# EAGLE design RHD2000_128_headstage (EAGLE 6.5.0)

## Sheet 1 of 3
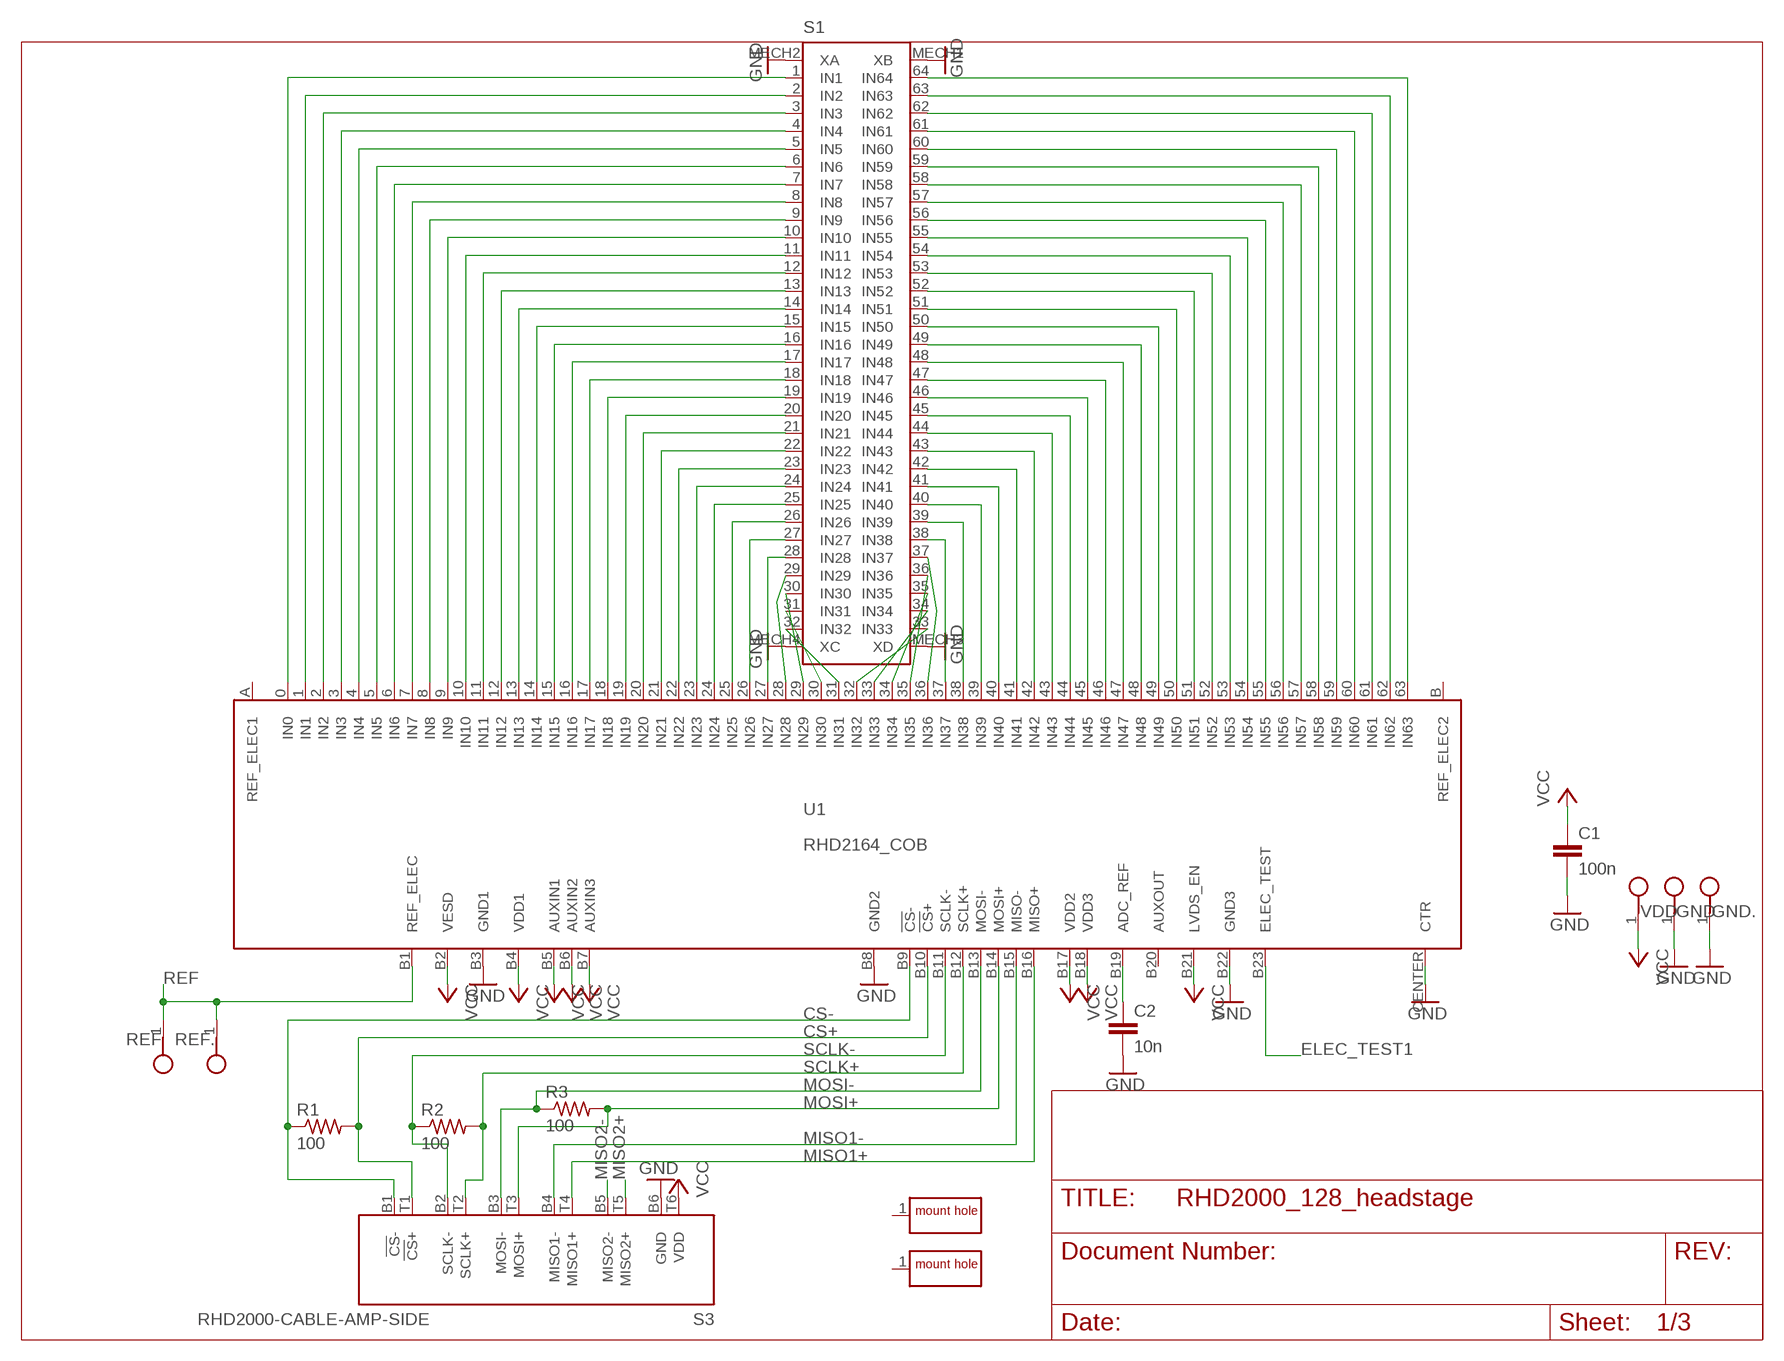
[diagram p0: schematic, sheet 1]

### Parts
C1  100n  C_0402  [0402]
C2  10n  C_0201  [0201]
GND  TESTPOINT_SMALL  [TESTPOINT_SMALL]
GND.  TESTPOINT_SMALL  [TESTPOINT_SMALL]
H1  MOUNTING_HOLE_60MIL  [MOUNTING_HOLE_60MIL]
H2  MOUNTING_HOLE_60MIL  [MOUNTING_HOLE_60MIL]
R1  100  R_0201  [0201]
R2  100  R_0201  [0201]
R3  100  R_0201  [0201]
REF  TESTPOINT_SMALL  [TESTPOINT_SMALL]
REF.  TESTPOINT_SMALL  [TESTPOINT_SMALL]
S1  MOLEX_SLIMSTACK_64  [MOLEX_SLIMSTACK_64]
S3  RHD2000-CABLE-AMP-SIDE  [OMNETICS_PZN-12-AA]
U1  RHD2164_COB  [RHD2164_COB]
VDD  TESTPOINT_SMALL  [TESTPOINT_SMALL]

### Nets
CS+: R1.2 S3.T1(!CS!+) U1.B10(!CS!+) ; also sheet 2
CS-: R1.1 S3.B1(!CS!-) U1.B9(!CS!-) ; also sheet 2
ELEC_TEST1: U1.B23(ELEC_TEST) ; also sheet 3
GND [thick]: C1.2 C2.2 GND.1 GND..1 S1.MECH1(XB) S1.MECH2(XA) S1.MECH3(XD) S1.MECH4(XC) S3.B6(GND) U1.B3(GND1) U1.B8(GND2) U1.B22(GND3) U1.CENTER(CTR) ; also sheet 2,3
MISO1+: S3.T4(MISO1+) U1.B16(MISO+)
MISO1-: S3.B4(MISO1-) U1.B15(MISO-)
MISO2+: S3.T5(MISO2+) ; also sheet 2
MISO2-: S3.B5(MISO2-) ; also sheet 2
MOSI+: R3.2 S3.T3(MOSI+) U1.B14(MOSI+) ; also sheet 2
MOSI-: R3.1 S3.B3(MOSI-) U1.B13(MOSI-) ; also sheet 2
N$2: S1.1(IN1) U1.0(IN0)
N$3: S1.2(IN2) U1.1(IN1)
N$4: S1.3(IN3) U1.2(IN2)
N$5: S1.4(IN4) U1.3(IN3)
N$6: S1.5(IN5) U1.4(IN4)
N$7: S1.6(IN6) U1.5(IN5)
N$8: S1.7(IN7) U1.6(IN6)
N$9: S1.8(IN8) U1.7(IN7)
N$10: S1.9(IN9) U1.8(IN8)
N$12: S1.10(IN10) U1.9(IN9)
N$13: S1.11(IN11) U1.10(IN10)
N$14: S1.12(IN12) U1.11(IN11)
N$15: S1.13(IN13) U1.12(IN12)
N$16: S1.14(IN14) U1.13(IN13)
N$17: S1.15(IN15) U1.14(IN14)
N$18: S1.16(IN16) U1.15(IN15)
N$19: S1.17(IN17) U1.16(IN16)
N$20: S1.18(IN18) U1.17(IN17)
N$21: S1.19(IN19) U1.18(IN18)
N$22: S1.20(IN20) U1.19(IN19)
N$23: S1.21(IN21) U1.20(IN20)
N$24: S1.22(IN22) U1.21(IN21)
N$25: S1.23(IN23) U1.22(IN22)
N$26: S1.24(IN24) U1.23(IN23)
N$27: S1.25(IN25) U1.24(IN24)
N$28: S1.26(IN26) U1.25(IN25)
N$29: S1.27(IN27) U1.26(IN26)
N$30: S1.28(IN28) U1.27(IN27)
N$31: S1.38(IN38) U1.37(IN37)
N$32: S1.39(IN39) U1.38(IN38)
N$33: S1.64(IN64) U1.63(IN63)
N$34: S1.63(IN63) U1.62(IN62)
N$41: S1.62(IN62) U1.61(IN61)
N$42 [thick]: C2.1 U1.B19(ADC_REF)
N$43: S1.61(IN61) U1.60(IN60)
N$44: S1.60(IN60) U1.59(IN59)
N$45: S1.59(IN59) U1.58(IN58)
N$46: S1.58(IN58) U1.57(IN57)
N$47: S1.57(IN57) U1.56(IN56)
N$48: S1.56(IN56) U1.55(IN55)
N$49: S1.55(IN55) U1.54(IN54)
N$50: S1.54(IN54) U1.53(IN53)
N$51: S1.53(IN53) U1.52(IN52)
N$52: S1.52(IN52) U1.51(IN51)
N$53: S1.51(IN51) U1.50(IN50)
N$54: S1.50(IN50) U1.49(IN49)
N$55: S1.49(IN49) U1.48(IN48)
N$56: S1.48(IN48) U1.47(IN47)
N$57: S1.47(IN47) U1.46(IN46)
N$58: S1.46(IN46) U1.45(IN45)
N$59: S1.45(IN45) U1.44(IN44)
N$60: S1.44(IN44) U1.43(IN43)
N$61: S1.43(IN43) U1.42(IN42)
N$62: S1.42(IN42) U1.41(IN41)
N$63: S1.41(IN41) U1.40(IN40)
N$64: S1.40(IN40) U1.39(IN39)
N$65: S1.32(IN32) U1.31(IN31)
N$66: S1.31(IN31) U1.30(IN30)
N$67: S1.30(IN30) U1.29(IN29)
N$68: S1.29(IN29) U1.28(IN28)
N$69: S1.33(IN33) U1.32(IN32)
N$70: S1.34(IN34) U1.33(IN33)
N$71: S1.35(IN35) U1.34(IN34)
N$72: S1.36(IN36) U1.35(IN35)
N$73: S1.37(IN37) U1.36(IN36)
REF [thick]: REF.1 REF..1 U1.B1(REF_ELEC) ; also sheet 2,3
SCLK+: R2.2 S3.T2(SCLK+) U1.B12(SCLK+) ; also sheet 2
SCLK-: R2.1 S3.B2(SCLK-) U1.B11(SCLK-) ; also sheet 2
VCC [thick]: C1.1 S3.T6(VDD) U1.B2(VESD) U1.B4(VDD1) U1.B5(AUXIN1) U1.B6(AUXIN2) U1.B7(AUXIN3) U1.B17(VDD2) U1.B18(VDD3) U1.B21(LVDS_EN) VDD.1 ; also sheet 2,3
Unconnected: H1.1 H2.1 U1.A(REF_ELEC1) U1.B20(AUXOUT) U1.B(REF_ELEC2)

## Sheet 2 of 3
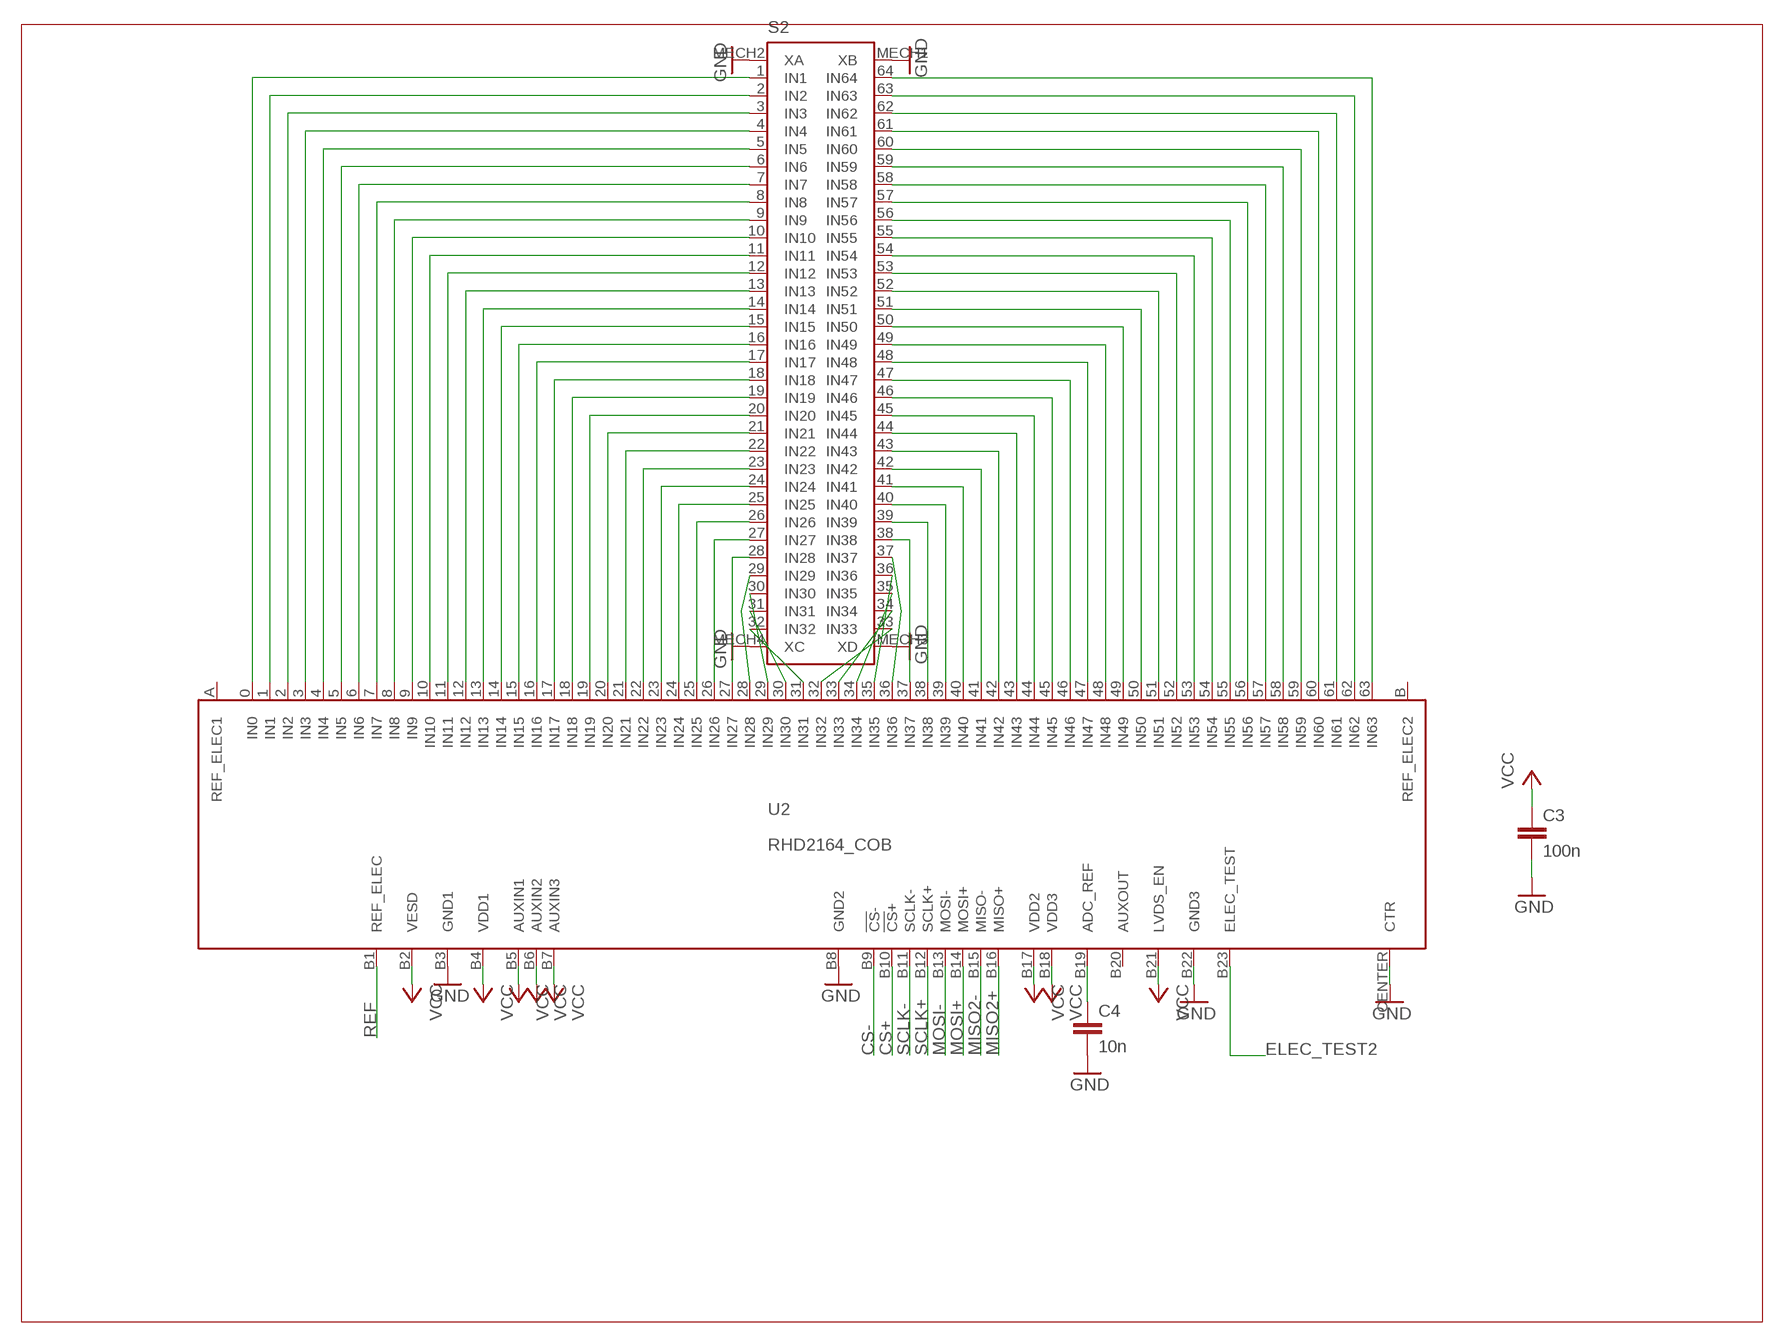
[diagram p1: schematic, sheet 2]

### Parts
C3  100n  C_0402  [0402]
C4  10n  C_0201  [0201]
S2  MOLEX_SLIMSTACK_64  [MOLEX_SLIMSTACK_64]
U2  RHD2164_COB  [RHD2164_COB]

### Nets
CS+: U2.B10(!CS!+) ; also sheet 1
CS-: U2.B9(!CS!-) ; also sheet 1
ELEC_TEST2: U2.B23(ELEC_TEST) ; also sheet 3
GND [thick]: C3.2 C4.2 S2.MECH1(XB) S2.MECH2(XA) S2.MECH3(XD) S2.MECH4(XC) U2.B3(GND1) U2.B8(GND2) U2.B22(GND3) U2.CENTER(CTR) ; also sheet 1,3
MISO2+: U2.B16(MISO+) ; also sheet 1
MISO2-: U2.B15(MISO-) ; also sheet 1
MOSI+: U2.B14(MOSI+) ; also sheet 1
MOSI-: U2.B13(MOSI-) ; also sheet 1
N$1 [thick]: C4.1 U2.B19(ADC_REF)
N$11: S2.1(IN1) U2.0(IN0)
N$35: S2.2(IN2) U2.1(IN1)
N$36: S2.3(IN3) U2.2(IN2)
N$37: S2.4(IN4) U2.3(IN3)
N$38: S2.5(IN5) U2.4(IN4)
N$39: S2.6(IN6) U2.5(IN5)
N$40: S2.7(IN7) U2.6(IN6)
N$74: S2.8(IN8) U2.7(IN7)
N$75: S2.9(IN9) U2.8(IN8)
N$76: S2.10(IN10) U2.9(IN9)
N$77: S2.11(IN11) U2.10(IN10)
N$78: S2.12(IN12) U2.11(IN11)
N$79: S2.13(IN13) U2.12(IN12)
N$80: S2.14(IN14) U2.13(IN13)
N$81: S2.15(IN15) U2.14(IN14)
N$82: S2.16(IN16) U2.15(IN15)
N$83: S2.17(IN17) U2.16(IN16)
N$84: S2.18(IN18) U2.17(IN17)
N$85: S2.19(IN19) U2.18(IN18)
N$86: S2.20(IN20) U2.19(IN19)
N$87: S2.21(IN21) U2.20(IN20)
N$88: S2.22(IN22) U2.21(IN21)
N$89: S2.23(IN23) U2.22(IN22)
N$90: S2.24(IN24) U2.23(IN23)
N$91: S2.25(IN25) U2.24(IN24)
N$92: S2.26(IN26) U2.25(IN25)
N$93: S2.27(IN27) U2.26(IN26)
N$94: S2.28(IN28) U2.27(IN27)
N$95: S2.38(IN38) U2.37(IN37)
N$96: S2.39(IN39) U2.38(IN38)
N$97: S2.64(IN64) U2.63(IN63)
N$98: S2.63(IN63) U2.62(IN62)
N$99: S2.62(IN62) U2.61(IN61)
N$100: S2.61(IN61) U2.60(IN60)
N$101: S2.60(IN60) U2.59(IN59)
N$102: S2.59(IN59) U2.58(IN58)
N$103: S2.58(IN58) U2.57(IN57)
N$104: S2.57(IN57) U2.56(IN56)
N$105: S2.56(IN56) U2.55(IN55)
N$106: S2.55(IN55) U2.54(IN54)
N$107: S2.54(IN54) U2.53(IN53)
N$108: S2.53(IN53) U2.52(IN52)
N$109: S2.52(IN52) U2.51(IN51)
N$110: S2.51(IN51) U2.50(IN50)
N$111: S2.50(IN50) U2.49(IN49)
N$112: S2.49(IN49) U2.48(IN48)
N$113: S2.48(IN48) U2.47(IN47)
N$114: S2.47(IN47) U2.46(IN46)
N$115: S2.46(IN46) U2.45(IN45)
N$116: S2.45(IN45) U2.44(IN44)
N$117: S2.44(IN44) U2.43(IN43)
N$118: S2.43(IN43) U2.42(IN42)
N$119: S2.42(IN42) U2.41(IN41)
N$120: S2.41(IN41) U2.40(IN40)
N$121: S2.40(IN40) U2.39(IN39)
N$122: S2.32(IN32) U2.31(IN31)
N$123: S2.31(IN31) U2.30(IN30)
N$124: S2.30(IN30) U2.29(IN29)
N$125: S2.29(IN29) U2.28(IN28)
N$126: S2.33(IN33) U2.32(IN32)
N$127: S2.34(IN34) U2.33(IN33)
N$128: S2.35(IN35) U2.34(IN34)
N$129: S2.36(IN36) U2.35(IN35)
N$130: S2.37(IN37) U2.36(IN36)
REF [thick]: U2.B1(REF_ELEC) ; also sheet 1,3
SCLK+: U2.B12(SCLK+) ; also sheet 1
SCLK-: U2.B11(SCLK-) ; also sheet 1
VCC [thick]: C3.1 U2.B2(VESD) U2.B4(VDD1) U2.B5(AUXIN1) U2.B6(AUXIN2) U2.B7(AUXIN3) U2.B17(VDD2) U2.B18(VDD3) U2.B21(LVDS_EN) ; also sheet 1,3
Unconnected: U2.A(REF_ELEC1) U2.B20(AUXOUT) U2.B(REF_ELEC2)

## Sheet 3 of 3
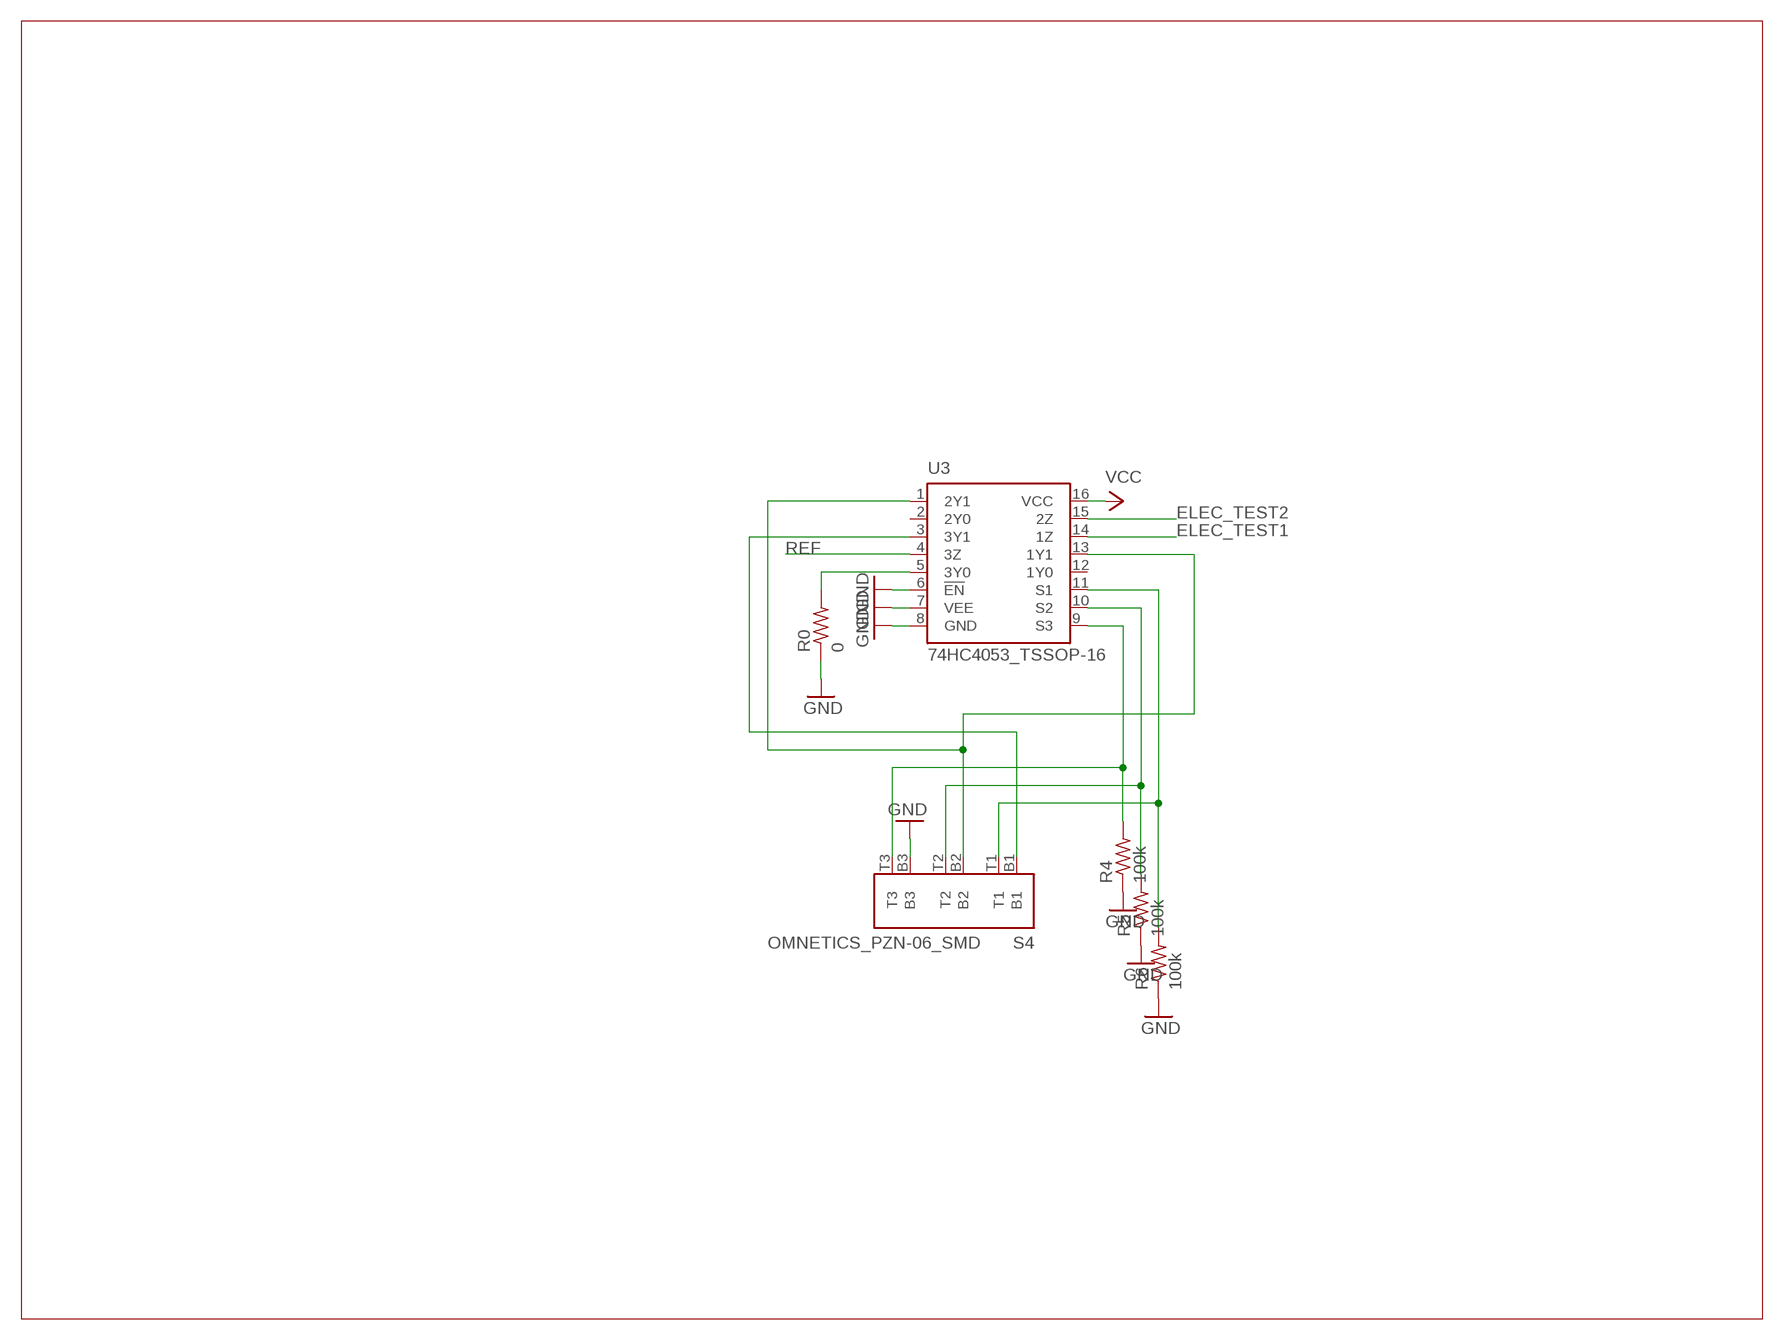
[diagram p2: schematic, sheet 3]

### Parts
R0  0  R_0402  [0402]
R4  100k  R_0201  [0201]
R5  100k  R_0201  [0201]
R6  100k  R_0201  [0201]
S4  OMNETICS_PZN-06_SMD  [OMNETICS_PZN-06-AA]
U3  74HC4053_TSSOP-16  [TSSOP-16]

### Nets
ELEC_TEST1: U3.14(1Z) ; also sheet 1
ELEC_TEST2: U3.15(2Z) ; also sheet 2
GND [thick]: R0.1 R4.1 R5.1 R6.1 S4.B3 U3.6(!EN!) U3.7(VEE) U3.8(GND) ; also sheet 1,2
N$131: R6.2 S4.T1 U3.11(S1)
N$132: R5.2 S4.T2 U3.10(S2)
N$133: R4.2 S4.T3 U3.9(S3)
N$134 [thick]: R0.2 U3.5(3Y0)
N$135 [thick]: S4.B1 U3.3(3Y1)
N$136: S4.B2 U3.1(2Y1) U3.13(1Y1)
REF [thick]: U3.4(3Z) ; also sheet 1,2
VCC [thick]: U3.16(VCC) ; also sheet 1,2
Unconnected: U3.2(2Y0) U3.12(1Y0)

## Library data of the parts
C1-C4 = RHD2000_eval_board:C: Capacitor
GND GND. REF REF. VDD = RHD2000_eval_board:TESTPOINT: PCB Test Point
H1 H2 = RHD2000_eval_board:MOUNTING_HOLE
R0 R1-R6 = RHD2000_eval_board:R: Resistor
S1 S2 = RHD2000:MOLEX_SLIMSTACK_64: Molex 64-pin SlimStack connector (DigiKey WM24076-ND)
S3 = RHD2000:RHD2000-CABLE-AMP-SIDE: Omnetics A79623 PZN-12-AA connector for SPI interface (amplifier side)
S4 = RHD2000:OMNETICS_PZN-06
U1 U2 = RHD2000:RHD2164: Intan Technologies RHD2164 chip
U3 = harrison:74HC4053

## Net classes
1 thick: width 0.102 mm
2 power: width 0.61 mm

## Board
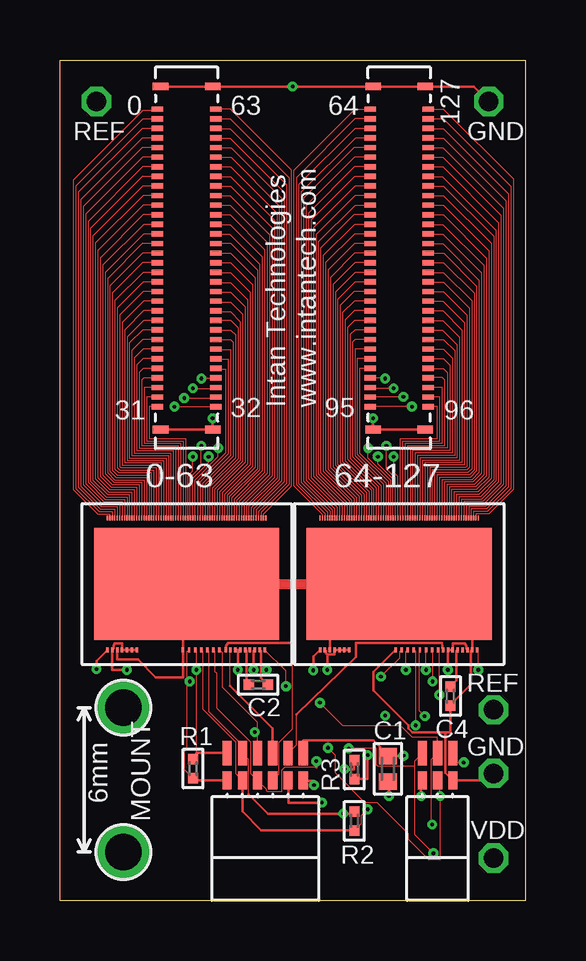
[diagram p3: board, top side]
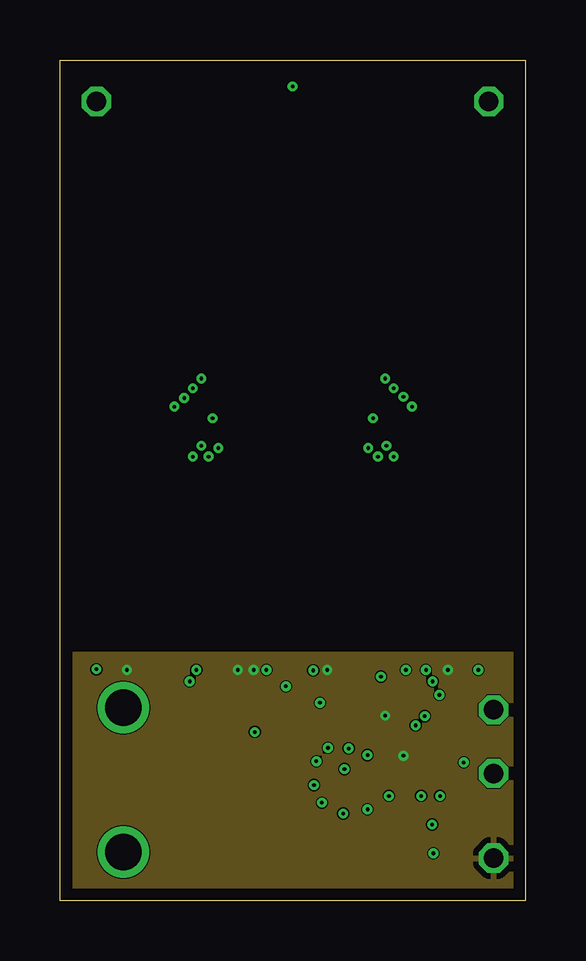
[diagram p4: board, inner layer Route2]
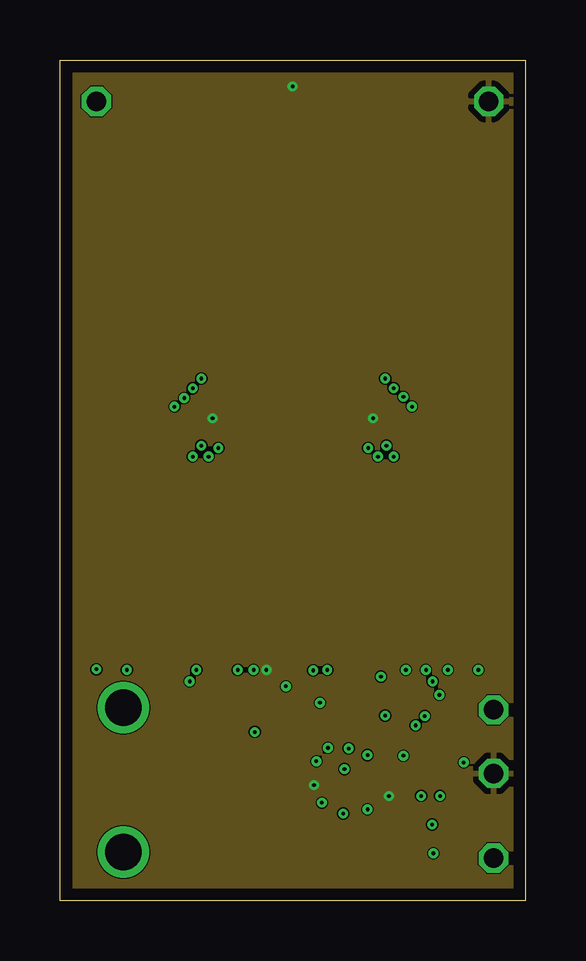
[diagram p5: board, inner layer Route3]
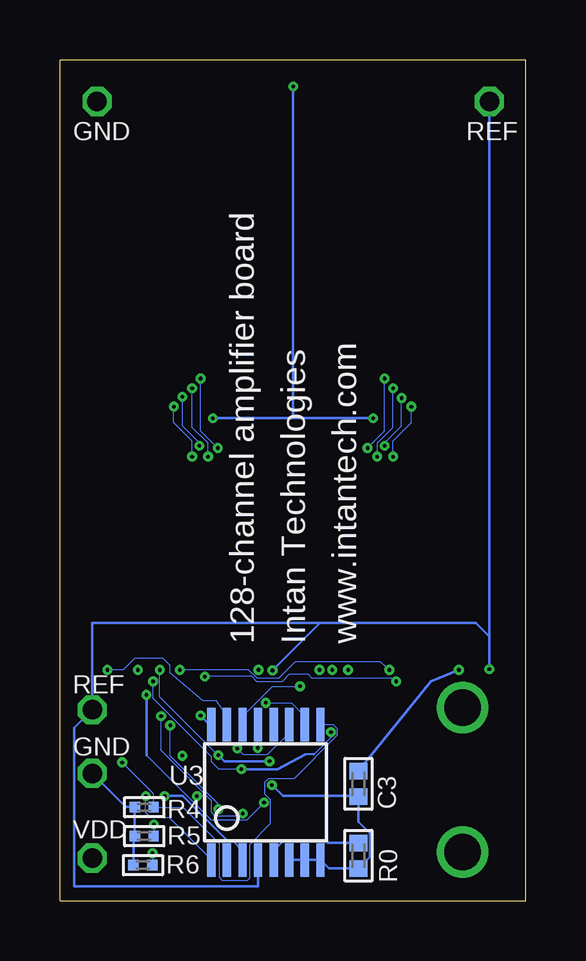
[diagram p6: board, bottom side, seen from below]

Size 19.43 x 35.05 mm. Coordinates in mm from the lower left corner, seen from the top.
Outline: 0,0 0,35.05 19.43,35.05 19.43,0 0,0
Copper layers (1*2+3*16): Top 0.035mm / dielectric 1.5mm / Route2 0.035mm / dielectric 0.15mm / Route3 0.035mm / dielectric 0.2mm / Bottom 0.035mm
Design rules "default *": minimum track width 2mil, minimum drill 6mil, track to track 2mil, track to pad 2mil, pad to pad 2mil, via to via 2mil, smd to smd 2mil, copper to edge 20mil, drill to drill 15mil, minimum pad ring 5mil, minimum via ring 5mil, stop-mask expansion 2mil, vias tented up to drill 0mil, thermal gap 10mil
tRestrict: area 5.2,10.3 to 5.3,10.6; area 5.5,10.3 to 5.5,10.6; area 5.7,10.3 to 5.8,10.6; area 6,10.3 to 6,10.6; area 6.5,10.3 to 6.6,10.6; area 6.2,10.3 to 6.3,10.6; area 14.1,10.3 to 14.1,10.6; area 14.4,10.3 to 14.4,10.6; area 14.6,10.3 to 14.7,10.6; area 14.9,10.3 to 14.9,10.6; area 15.1,10.3 to 15.2,10.6; area 15.4,10.3 to 15.4,10.6; 1 more areas
vRestrict: area 0.9,9.8 to 18.6,16.5; area 8.9,16.5 to 10.5,17.3

### Footprints (pad centres in the part's own frame; a part is rotated, then mirrored left to right if it is on the bottom)
0402 = smd 0.686 x 0.762: 1 -0.533,0; 2 0.533,0
0201 = smd 0.432 x 0.432: 1 -0.394,0; 2 0.394,0
TESTPOINT_SMALL = drill 0.813 octagon: 1 0,0
MOUNTING_HOLE_60MIL = drill 1.524 pad 2.108: 1 0,0
MOLEX_SLIMSTACK_64 = smd 0.22 x 0.475: 1 -6.2,-1.212; 2 -5.8,-1.212; 3 -5.4,-1.212; 4 -5,-1.212; 5 -4.6,-1.212; 6 -4.2,-1.212; 7 -3.8,-1.212; 8 -3.4,-1.212; 9 -3,-1.212; 10 -2.6,-1.212; 11 -2.2,-1.212; 12 -1.8,-1.212; 13 -1.4,-1.212; 14 -1,-1.212; 15 -0.6,-1.212; 16 -0.2,-1.212; 17 0.2,-1.212; 18 0.6,-1.212; 19 1,-1.212; 20 1.4,-1.212; 21 1.8,-1.212; 22 2.2,-1.212; 23 2.6,-1.212; 24 3,-1.212; 25 3.4,-1.212; 26 3.8,-1.212; 27 4.2,-1.212; 28 4.6,-1.212; 29 5,-1.212; 30 5.4,-1.212; 31 5.8,-1.212; 32 6.2,-1.212; 33 6.2,1.212; 34 5.8,1.212; 35 5.4,1.212; 36 5,1.212; 37 4.6,1.212; 38 4.2,1.212; 39 3.8,1.212; 40 3.4,1.212; 41 3,1.212; 42 2.6,1.212; 43 2.2,1.212; 44 1.8,1.212; 45 1.4,1.212; 46 1,1.212; 47 0.6,1.212; 48 0.2,1.212; 49 -0.2,1.212; 50 -0.6,1.212; 51 -1,1.212; 52 -1.4,1.212; 53 -1.8,1.212; 54 -2.2,1.212; 55 -2.6,1.212; 56 -3,1.212; 57 -3.4,1.212; 58 -3.8,1.212; 59 -4.2,1.212; 60 -4.6,1.212; 61 -5,1.212; 62 -5.4,1.212; 63 -5.8,1.212; 64 -6.2,1.212 | smd 0.32 x 0.65: MECH1 -7.15,1.085; MECH2 -7.15,-1.085; MECH3 7.15,1.085; MECH4 7.15,-1.085
OMNETICS_PZN-12-AA = smd 0.381 x 0.762: B1 1.587,-1.016; B2 0.953,-1.016; B3 0.318,-1.016; B4 -0.318,-1.016; B5 -0.953,-1.016; B6 -1.587,-1.016 | smd 0.381 x 1.016: T1 1.587,-2.159; T2 0.953,-2.159; T3 0.318,-2.159; T4 -0.318,-2.159; T5 -0.953,-2.159; T6 -1.587,-2.159
OMNETICS_PZN-06-AA = smd 0.381 x 0.762: B1 0.635,-1.016; B2 0,-1.016; B3 -0.635,-1.016 | smd 0.381 x 1.016: T1 0.635,-2.159; T2 0,-2.159; T3 -0.635,-2.159
RHD2164_COB = smd 0.051 x 0.203: 0 -3.2,2.743; 1 -3.099,2.743; 2 -2.997,2.743; 3 -2.896,2.743; 4 -2.794,2.743; 5 -2.692,2.743; 6 -2.591,2.743; 7 -2.489,2.743; 8 -2.388,2.743; 9 -2.286,2.743; 10 -2.184,2.743; 11 -2.083,2.743; 12 -1.981,2.743; 13 -1.88,2.743; 14 -1.778,2.743; 15 -1.676,2.743; 16 -1.575,2.743; 17 -1.473,2.743; 18 -1.372,2.743; 19 -1.27,2.743; 20 -1.168,2.743; 21 -1.067,2.743; 22 -0.965,2.743; 23 -0.864,2.743; 24 -0.762,2.743; 25 -0.66,2.743; 26 -0.559,2.743; 27 -0.457,2.743; 28 -0.356,2.743; 29 -0.254,2.743; 30 -0.152,2.743; 31 -0.051,2.743; 32 0.051,2.743; 33 0.152,2.743; 34 0.254,2.743; 35 0.356,2.743; 36 0.457,2.743; 37 0.559,2.743; 38 0.66,2.743; 39 0.762,2.743; 40 0.864,2.743; 41 0.965,2.743; 42 1.067,2.743; 43 1.168,2.743; 44 1.27,2.743; 45 1.372,2.743; 46 1.473,2.743; 47 1.575,2.743; 48 1.676,2.743; 49 1.778,2.743; 50 1.88,2.743; 51 1.981,2.743; 52 2.083,2.743; 53 2.184,2.743; 54 2.286,2.743; 55 2.388,2.743; 56 2.489,2.743; 57 2.591,2.743; 58 2.692,2.743; 59 2.794,2.743; 60 2.896,2.743; 61 2.997,2.743; 62 3.099,2.743; 63 3.2,2.743; A -3.302,2.743; B 3.302,2.743 | smd 0.102 x 0.203: B1 -3.302,-2.743; B2 -3.099,-2.743; B3 -2.896,-2.743; B4 -2.692,-2.743; B5 -2.489,-2.743; B6 -2.286,-2.743; B7 -2.083,-2.743; B8 -0.152,-2.743; B9 0.102,-2.743; B10 0.356,-2.743; B11 0.61,-2.743; B12 0.864,-2.743; B13 1.118,-2.743; B14 1.372,-2.743; B15 1.626,-2.743; B16 1.829,-2.743; B17 2.032,-2.743; B18 2.235,-2.743; B19 2.438,-2.743; B20 2.642,-2.743; B21 2.845,-2.743; B22 3.048,-2.743; B23 3.251,-2.743 | smd 7.722 x 4.674: CENTER 0,0
TSSOP-16 = smd 0.348 x 1.397: 1 -2.273,-2.814; 2 -1.623,-2.815; 3 -0.973,-2.815; 4 -0.323,-2.815; 5 0.327,-2.815; 6 0.977,-2.815; 7 1.627,-2.815; 8 2.277,-2.815; 9 2.277,2.825; 10 1.627,2.825; 11 0.977,2.825; 12 0.327,2.825; 13 -0.323,2.825; 14 -0.973,2.825; 15 -1.623,2.825; 16 -2.273,2.825

### Placement (x,y rotation side)
C1  13.68,5.5 270 top
C2  8.27,9 0 top
C3  6.99,4.88 270 bottom
C4  16.28,8.53 270 top
GND  18.08,5.31 0 top
GND.  17.88,33.32 180 top
H1  2.64,8.05 0 top
H2  2.64,2.03 0 top
R0  6.99,1.88 90 bottom
R1  5.55,5.51 90 top
R2  12.28,3.33 90 top
R3  12.28,5.47 90 top
R4  15.92,3.9 0 bottom
R5  15.92,2.69 0 bottom
R6  15.97,1.49 0 bottom
REF  18.08,7.96 0 top
REF.  1.52,33.32 0 top
S1  5.28,26.8 270 top
S2  14.15,26.8 270 top
S3  8.56,4 180 top
S4  15.75,4 180 top
U1  5.28,13.21 0 top
U2  14.15,13.21 0 top
U3  10.85,4.52 0 bottom
VDD  18.08,1.78 0 top

### Tracks (layer width: path | path; a pad name or v marks a point on that pad's centre or on a via)
CS+  (via drill 0.15)
  Top 0.051: U1.B10 5.69,10.41 v5.69,9.63 5.69,6.17 | R1.2 5.69,6.04 | U2.B10 14.43,10.39 v14.43,9.63 | 6.96,6.17 S3.T1
  Top 0.102: 5.69,6.04 5.69,6.17 6.96,6.17
  Bottom 0.051: v14.43,9.63 11.56,9.63 11.2,9.27 10.31,9.27 9.63,9.96 6.07,9.96 v5.69,9.63
CS-  (via drill 0.15)
  Top 0.051: U1.B9 5.31,10.39 5.31,9.14 | 5.31,9.14 5.31,6.33 5.21,6.22 5.21,5.46 R1.1 5.56,5.11 5.56,5.03 | U2.B9 14.17,10.39 14.17,10.13 v13.39,9.35 | 5.31,9.14 v5.41,9.14 | S3.B1
  Top 0.102: 5.56,5.03 S3.B1
  Bottom 0.051: v13.39,9.35 11.43,9.35 11.23,9.14 10.16,9.14 9.86,9.45 9.09,9.45 8.94,9.3 5.56,9.3 v5.41,9.14 5.49,9.22
ELEC_TEST1  (via drill 0.15)
  Top 0.051: U1.B23 9.42,9.58 v9.42,8.94
  Bottom 0.051: v9.42,8.94 10.57,8.94 11.81,7.7 11.81,7.37 U3.14
ELEC_TEST2  (via drill 0.15)
  Top 0.051: U2.B23 17.45,10.41 v17.45,9.63
  Bottom 0.051: v17.45,9.63 16.79,9.63 16.31,10.11 15.14,10.11 14.83,9.8 14.83,9.5 13.46,8.33 12.9,8.33 12.47,7.7 12.47,7.37 U3.15
GND  (via drill 0.15)
  Top 0.102: v6.37,20.12 | v6.37,20.12 S1.MECH3 S1.MECH4 | S2.MECH3 S2.MECH4 v13.06,20.12 | S1.MECH2 S1.MECH1 | S1.MECH1 v9.7,33.95 9.71,33.95 S2.MECH2 S2.MECH1 17.26,33.95 GND..1 | S1.MECH1 | U2.B8 13.08,9.55 13.08,8.76 14.53,7.32 14.53,7.19 14.71,7.01 16.08,7.01 | 16.08,7.01 16.28,7.01 C4.2 16.31,8.18 17.14,9.02 17.14,10.41 U2.B22 17.2,13.21 U2.CENTER 11.25,13.21 U2.B3 | U1.B22 8.38,10.41 8.38,9.63 | 8.38,9.63 8.38,9.3 8.66,9.02 C2.2 | S3.B6 10.19,5 10.59,5 v10.59,4.83 | C1.2 13.72,4.93 v13.72,4.37 | GND.1 18.09,5.03 S4.B3 16.36,5.05 16.08,5.33 16.08,7.01 | v8.61,9.63 8.38,9.63 | U1.CENTER 5.13,13.21 U1.B8 5.13,9.32 3.99,9.32 3.25,10.06 2.39,10.06 U1.B3
  Top 0.406: U1.CENTER U2.CENTER
  Bottom 0.102: v6.37,20.12 v13.06,20.12 9.7,20.12 v9.7,33.95 | U3.8 8.2,1.35 R0.1 6.5,1.83 6.5,2.82 6.99,3.3 C3.2 7.01,4.37 10.13,4.37 v10.59,4.83 | 8.59,1.7 U3.8 | U3.8 8.64,1.7 9.2,1.7 U3.7 9.27,1.7 9.86,1.7 U3.6 | R6.1 16.36,2.69 R5.1 16.31,2.72 16.31,3.89 R4.1 16.36,3.91 16.69,3.91 GND.1
  pour Route3: 0.25,0.41 0.25,34.44 19.05,34.44 19.05,0.41
MISO1+
  Top 0.051: U1.B16 7.09,10.44 7.09,8.97 | 8.87,6.17 S3.T4
  Top 0.102: 7.09,8.97 8.87,7.19 8.87,6.17
MISO1-
  Top 0.051: 9.7,10.74 9.7,7.16 9.14,6.6 9.14,5.28 S3.B4
  Top 0.102: U1.B15 6.93,10.54 6.93,10.62 7.01,10.74 9.7,10.74
MISO2+
  Top 0.051: 9.86,7.77 9.86,6.5 S3.T5
  Top 0.102: U2.B16 15.95,10.54 15.95,10.62 15.93,10.74 12.34,10.74 12.34,10.16 9.86,7.77
MISO2-  (via drill 0.15)
  Top 0.051: U2.B15 15.82,10.41 v15.82,8.59 | 9.53,5 S3.B5
  Top 0.102: v10.92,4.09 9.53,4.09 9.53,5
  Bottom 0.051: 15.82,6.07 13.11,3.35 11.66,3.35 v10.92,4.09
  Bottom 0.102: 15.82,6.07 v15.82,8.59
MOSI+  (via drill 0.15)
  Top 0.051: U1.B14 6.78,10.34 6.78,8.89 8.23,7.44 8.23,7.04 | 8.23,7.04 8.23,6.17 S3.T3 | U2.B14 15.54,10.44 v15.54,9.14 | 12.27,5.87 R3.2 | v8.13,7.04 8.23,7.04
  Top 0.102: v11.86,5.49 12.27,5.49 12.27,5.87
  Bottom 0.051: v15.54,9.14 15.54,8.43 13.11,5.99 13.11,5.79 12.8,5.49 v11.86,5.49 | v8.13,7.04 8.13,6.81 8.84,6.1
  Bottom 0.076: 8.84,6.1 9.2,6.1
  Bottom 0.102: 9.2,6.1 10.36,5.49 v11.86,5.49
MOSI-  (via drill 0.15)
  Top 0.051: U1.B13 6.48,10.39 6.48,9.55 6.55,9.47 6.55,8.03 7.98,6.6 7.98,5.28 S3.B3 8.61,4.65 8.61,4.6 8.66,4.55 9.25,4.55 9.25,5.44 9.37,5.56 10.69,5.56 | v15.27,9.63 U2.B13
  Top 0.102: v10.69,5.82 10.69,5.56 | R3.1 12.83,5.08 v12.83,6.07
  Bottom 0.051: v15.27,9.63 15.27,8.51 v12.83,6.07
  Bottom 0.102: v10.69,5.82 12.57,5.82 v12.83,6.07
N$1
  Top 0.102: U2.B19 16.54,10.41 16.54,9.2 16.28,8.94 C4.1
N$2
  Top 0.051: S1.1 4.12,33 4.12,32.94 3.45,32.94 0.56,30.05 0.56,17.14 1.57,16.13 2.08,16.13 U1.0
N$3
  Top 0.051: S1.2 4.06,32.59 3.45,32.59 0.66,29.79 0.66,17.2 1.63,16.23 2.18,16.23 U1.1
N$4
  Top 0.051: S1.3 3.42,32.2 0.76,29.54 0.76,17.25 1.68,16.33 2.29,16.33 U1.2
N$5
  Top 0.051: S1.4 3.42,31.8 0.86,29.23 0.86,17.3 1.73,16.43 2.39,16.43 U1.3
N$6
  Top 0.051: S1.5 3.43,31.4 0.96,28.93 0.96,17.35 1.78,16.54 2.49,16.54 U1.4
N$7
  Top 0.051: S1.6 3.44,31 1.07,28.63 1.07,17.4 1.83,16.64 2.59,16.64 U1.5
N$8
  Top 0.051: S1.7 3.44,30.6 1.17,28.32 1.17,17.45 1.88,16.74 2.69,16.74 U1.6
N$9
  Top 0.051: S1.8 3.46,30.2 3.45,30.2 1.27,28.02 1.27,17.5 1.93,16.84 2.79,16.84 U1.7
N$10
  Top 0.051: S1.9 3.45,29.8 3.45,29.79 1.37,27.71 1.37,17.55 1.98,16.94 2.9,16.94 U1.8
N$11
  Top 0.051: U2.0 10.95,16.1 9.75,17.3 9.75,30.45 12.29,32.99 S2.1
N$12
  Top 0.051: S1.10 3.46,29.4 1.47,27.41 1.47,17.6 2.03,17.04 3,17.04 U1.9
N$13
  Top 0.051: S1.11 3.47,29 1.57,27.1 1.57,17.65 2.08,17.14 3.1,17.14 U1.10
N$14
  Top 0.051: S1.12 3.48,28.6 1.68,26.8 1.68,17.7 2.13,17.25 3.2,17.25 U1.11
N$15
  Top 0.051: S1.13 3.48,28.2 1.78,26.49 1.78,17.75 2.18,17.35 3.3,17.35 U1.12
N$16
  Top 0.051: S1.14 3.49,27.8 1.88,26.19 1.88,17.8 2.23,17.45 3.4,17.45 U1.13
N$17
  Top 0.051: S1.15 3.46,27.4 3.45,27.41 1.98,25.93 1.98,17.86 2.29,17.55 3.5,17.55 U1.14
N$18
  Top 0.051: S1.16 3.46,27 3.45,27 2.08,25.63 2.08,17.91 2.34,17.65 3.61,17.65 U1.15
N$19
  Top 0.051: S1.17 3.46,26.6 2.18,25.32 2.18,17.96 2.39,17.75 3.71,17.75 U1.16
N$20
  Top 0.051: S1.18 3.46,26.2 2.29,25.02 2.29,18.01 2.44,17.86 3.81,17.86 U1.17
N$21
  Top 0.051: S1.19 3.47,25.8 2.39,24.71 2.39,18.06 2.49,17.96 3.91,17.96 U1.18
N$22
  Top 0.051: S1.20 3.48,25.4 2.49,24.41 2.49,18.11 2.54,18.06 4.01,18.06 U1.19
N$23
  Top 0.051: S1.21 3.48,25 2.59,24.11 2.59,18.16 4.12,18.16 U1.20
N$24
  Top 0.051: S1.22 3.49,24.6 2.69,23.8 2.69,18.26 4.22,18.26 U1.21
N$25
  Top 0.051: S1.23 3.5,24.2 2.79,23.5 2.79,18.36 4.32,18.36 U1.22
N$26
  Top 0.051: S1.24 3.46,23.8 3.45,23.8 2.9,23.24 2.9,18.47 4.42,18.47 U1.23
N$27
  Top 0.051: S1.25 3.46,23.4 3,22.94 3,18.57 4.52,18.57 U1.24
N$28
  Top 0.051: S1.26 3.46,23 3.1,22.63 3.1,18.67 4.62,18.67 U1.25
N$29
  Top 0.051: S1.27 3.47,22.6 3.2,22.33 3.2,18.77 4.72,18.77 U1.26
N$30
  Top 0.051: S1.28 3.48,22.2 3.3,22.02 3.3,18.87 4.83,18.87 U1.27
N$31
  Top 0.051: S1.38 6.51,22.58 7.01,22.58 7.01,18.62 5.84,17.45 U1.37
N$32
  Top 0.051: S1.39 6.51,22.99 7.11,22.99 7.11,18.57 5.94,17.4 U1.38
N$33
  Top 0.051: U1.63 8.48,16.13 9.65,17.3 9.65,30.45 7.11,32.99 S1.64
N$34
  Top 0.051: S1.63 7.1,32.6 9.55,30.15 9.55,17.35 8.38,16.18 U1.62
N$35
  Top 0.051: S2.2 12.3,32.6 9.86,30.15 9.86,17.35 11.05,16.15 U2.1
N$36
  Top 0.051: S2.3 12.31,32.2 9.96,29.84 9.96,17.4 11.15,16.2 U2.2
N$37
  Top 0.051: S2.4 12.31,31.8 10.06,29.54 10.06,17.45 11.25,16.26 U2.3
N$38
  Top 0.051: S2.5 12.27,31.4 10.16,29.29 10.16,17.5 11.35,16.31 U2.4
N$39
  Top 0.051: S2.6 12.28,31 10.26,28.98 10.26,17.55 11.46,16.36 U2.5
N$40
  Top 0.051: S2.7 12.28,30.6 10.36,28.68 10.36,17.6 11.56,16.41 U2.6
N$41
  Top 0.051: S1.62 7.1,32.2 9.45,29.84 9.45,17.4 8.28,16.23 U1.61
N$42
  Top 0.102: U1.B19 7.77,10.41 7.77,9.12 7.87,9.02 C2.1
N$43
  Top 0.051: S1.61 7.09,31.8 9.35,29.54 9.35,17.45 8.18,16.28 U1.60
N$44
  Top 0.051: S1.60 7.13,31.4 9.25,29.29 9.25,17.5 8.08,16.33 U1.59
N$45
  Top 0.051: S1.59 7.13,31 9.14,28.98 9.14,17.55 7.98,16.38 U1.58
N$46
  Top 0.051: S1.58 7.12,30.6 9.04,28.68 9.04,17.6 7.87,16.43 U1.57
N$47
  Top 0.051: S1.57 7.12,30.2 8.94,28.37 8.94,17.65 7.77,16.48 U1.56
N$48
  Top 0.051: S1.56 7.11,29.8 8.84,28.07 8.84,17.7 7.67,16.54 U1.55
N$49
  Top 0.051: S1.55 7.1,29.4 8.74,27.76 8.74,17.75 7.57,16.59 U1.54
N$50
  Top 0.051: S1.54 7.1,29 8.64,27.46 8.64,17.8 7.47,16.64 U1.53
N$51
  Top 0.051: S1.53 7.09,28.6 8.53,27.15 8.53,17.86 7.37,16.69 U1.52
N$52
  Top 0.051: S1.52 7.08,28.2 8.43,26.85 8.43,17.91 7.26,16.74 U1.51
N$53
  Top 0.051: S1.51 7.08,27.8 8.33,26.54 8.33,17.96 7.16,16.79 U1.50
N$54
  Top 0.051: S1.50 7.11,27.41 8.23,26.29 8.23,18.01 7.06,16.84 U1.49
N$55
  Top 0.051: S1.49 7.11,27 8.13,25.98 8.13,18.06 6.96,16.89 U1.48
N$56
  Top 0.051: S1.48 7.11,26.59 8.03,25.68 8.03,18.11 6.86,16.94 U1.47
N$57
  Top 0.051: S1.47 6.5,26.19 7.11,26.19 7.92,25.38 7.92,18.16 6.76,16.99 U1.46
N$58
  Top 0.051: S1.46 6.51,25.78 7.11,25.78 7.82,25.07 7.82,18.21 6.66,17.04 U1.45
N$59
  Top 0.051: S1.45 6.52,25.38 7.11,25.38 7.72,24.77 7.72,18.26 6.55,17.09 U1.44
N$60
  Top 0.051: S1.44 6.52,24.97 7.11,24.97 7.62,24.46 7.62,18.31 6.45,17.14 U1.43
N$61
  Top 0.051: S1.43 6.53,24.56 7.11,24.56 7.52,24.16 7.52,18.36 6.35,17.2 U1.42
N$62
  Top 0.051: S1.42 7.11,24.21 7.42,23.9 7.42,18.41 6.25,17.25 U1.41
N$63
  Top 0.051: S1.41 7.11,23.8 7.32,23.6 7.32,18.47 6.15,17.3 U1.40
N$64
  Top 0.051: S1.40 7.11,23.39 7.21,23.29 7.21,18.52 6.04,17.35 U1.39
N$65
  Top 0.051: S1.32 3.71,20.6 3.71,19.28 5.23,19.28 U1.31
N$66
  Top 0.051: S1.31 3.61,21 3.61,19.18 5.13,19.18 U1.30
N$67
  Top 0.051: S1.30 3.5,21.4 3.5,19.07 5.03,19.07 U1.29
N$68
  Top 0.051: S1.29 3.48,21.8 3.4,21.72 3.4,18.97 4.93,18.97 U1.28
N$69  (via drill 0.15)
  Top 0.051: U1.32 5.33,17.7 5.54,17.91 v5.54,18.52 | v4.78,20.6 S1.33
  Bottom 0.051: v5.54,18.52 5.54,19.18 4.78,19.94 v4.78,20.6
N$70  (via drill 0.15)
  Top 0.051: U1.33 5.44,17.65 5.89,18.11 v5.89,18.97 | v5.18,20.95 6.5,20.95 S1.34
  Bottom 0.051: v5.89,18.97 5.89,19.07 5.18,19.79 v5.18,20.95
N$71  (via drill 0.15)
  Top 0.051: U1.34 5.54,17.6 6.2,18.26 v6.2,18.52 | v5.54,21.36 6.48,21.36 S1.35
  Bottom 0.051: v6.2,18.52 6.2,19.07 5.54,19.74 v5.54,21.36
N$72  (via drill 0.15)
  Top 0.051: U1.35 5.64,17.55 6.6,18.52 v6.6,18.87 | v5.89,21.77 5.92,21.8 S1.36
  Bottom 0.051: v6.6,18.87 5.89,19.58 v5.89,21.77
N$73
  Top 0.051: S1.37 6.52,22.17 6.91,22.17 6.91,18.67 5.74,17.5 U1.36
N$74
  Top 0.051: S2.8 12.29,30.2 10.46,28.37 10.46,17.65 11.66,16.46 U2.7
N$75
  Top 0.051: S2.9 12.3,29.8 10.57,28.07 10.57,17.7 11.76,16.51 U2.8
N$76
  Top 0.051: S2.10 12.3,29.4 10.67,27.76 10.67,17.75 11.86,16.56 U2.9
N$77
  Top 0.051: S2.11 12.92,28.98 12.29,28.98 10.77,27.46 10.77,17.8 11.96,16.61 U2.10
N$78
  Top 0.051: S2.12 12.27,28.6 10.87,27.2 10.87,17.86 12.06,16.66 U2.11
N$79
  Top 0.051: S2.13 12.27,28.2 10.97,26.9 10.97,17.91 12.17,16.71 U2.12
N$80
  Top 0.051: S2.14 12.28,27.8 11.07,26.59 11.07,17.96 12.27,16.76 U2.13
N$81
  Top 0.051: S2.15 12.28,27.4 11.18,26.29 11.18,18.01 12.37,16.82 U2.14
N$82
  Top 0.051: S2.16 12.29,27 11.28,25.98 11.28,18.06 12.47,16.87 U2.15
N$83
  Top 0.051: S2.17 12.3,26.6 11.38,25.68 11.38,18.11 12.57,16.92 U2.16
N$84
  Top 0.051: S2.18 12.3,26.2 11.48,25.38 11.48,18.16 12.68,16.97 U2.17
N$85
  Top 0.051: S2.19 12.31,25.8 11.58,25.07 11.58,18.21 12.78,17.02 U2.18
N$86
  Top 0.051: S2.20 12.27,25.4 11.68,24.82 11.68,18.26 12.88,17.07 U2.19
N$87
  Top 0.051: S2.21 12.27,25 11.79,24.51 11.79,18.31 12.98,17.12 U2.20
N$88
  Top 0.051: S2.22 12.28,24.6 11.89,24.21 11.89,18.36 13.08,17.17 U2.21
N$89
  Top 0.051: S2.23 12.28,24.2 11.99,23.9 11.99,18.41 13.18,17.22 U2.22
N$90
  Top 0.051: S2.24 12.29,23.8 12.09,23.6 12.09,18.47 13.28,17.27 U2.23
N$91
  Top 0.051: S2.25 12.3,23.4 12.19,23.29 12.19,18.52 13.39,17.32 U2.24
N$92
  Top 0.051: S2.26 12.3,23 12.29,22.99 12.29,18.57 13.49,17.37 U2.25
N$93
  Top 0.051: S2.27 12.39,22.6 12.39,18.62 13.59,17.42 U2.26
N$94
  Top 0.051: S2.28 12.5,22.2 12.5,18.67 13.69,17.48 U2.27
N$95
  Top 0.051: S2.38 15.99,22.6 16.26,22.33 16.26,18.77 14.71,18.77 U2.37
N$96
  Top 0.051: S2.39 15.99,23 16.36,22.63 16.36,18.67 14.81,18.67 U2.38
N$97
  Top 0.051: S2.64 16,33 18.9,30.1 18.9,17.14 17.88,16.13 17.35,16.13 U2.63
N$98
  Top 0.051: S2.63 15.99,32.6 18.8,29.79 18.8,17.2 17.83,16.23 17.25,16.23 U2.62
N$99
  Top 0.051: S2.62 15.99,32.2 18.69,29.49 18.69,17.25 17.78,16.33 17.14,16.33 U2.61
N$100
  Top 0.051: S2.61 15.98,31.8 18.59,29.18 18.59,17.3 17.73,16.43 17.04,16.43 U2.60
N$101
  Top 0.051: S2.60 15.97,31.4 18.49,28.88 18.49,17.35 17.68,16.54 16.94,16.54 U2.59
N$102
  Top 0.051: S2.59 15.97,31 18.39,28.57 18.39,17.4 17.63,16.64 16.84,16.64 U2.58
N$103
  Top 0.051: S2.58 15.96,30.6 18.29,28.27 18.29,17.45 17.58,16.74 16.74,16.74 U2.57
N$104
  Top 0.051: S2.57 15.96,30.2 18.19,27.96 18.19,17.5 17.53,16.84 16.64,16.84 U2.56
N$105
  Top 0.051: S2.56 16,29.8 18.09,27.71 18.09,17.55 17.48,16.94 16.54,16.94 U2.55
N$106
  Top 0.051: S2.55 15.99,29.4 17.98,27.41 17.98,17.6 17.42,17.04 16.43,17.04 U2.54
N$107
  Top 0.051: S2.54 15.99,29 17.88,27.1 17.88,17.65 17.37,17.14 16.33,17.14 U2.53
N$108
  Top 0.051: S2.53 15.98,28.6 17.78,26.8 17.78,17.7 17.32,17.25 16.23,17.25 U2.52
N$109
  Top 0.051: S2.52 15.97,28.2 17.68,26.49 17.68,17.75 17.27,17.35 16.13,17.35 U2.51
N$110
  Top 0.051: S2.51 15.97,27.8 17.58,26.19 17.58,17.8 17.22,17.45 16.03,17.45 U2.50
N$111
  Top 0.051: S2.50 15.96,27.4 17.48,25.88 17.48,17.86 17.17,17.55 15.93,17.55 U2.49
N$112
  Top 0.051: S2.49 16,27 17.37,25.63 17.37,17.91 17.12,17.65 15.82,17.65 U2.48
N$113
  Top 0.051: S2.48 16,26.6 17.27,25.32 17.27,17.96 17.07,17.75 15.72,17.75 U2.47
N$114
  Top 0.051: S2.47 15.99,26.2 17.17,25.02 17.17,18.01 17.02,17.86 15.62,17.86 U2.46
N$115
  Top 0.051: S2.46 15.99,25.8 17.07,24.71 17.07,18.06 16.97,17.96 15.52,17.96 U2.45
N$116
  Top 0.051: S2.45 15.98,25.4 16.97,24.41 16.97,18.11 16.92,18.06 15.42,18.06 U2.44
N$117
  Top 0.051: S2.44 15.97,25 16.87,24.11 16.87,18.16 15.32,18.16 U2.43
N$118
  Top 0.051: S2.43 15.97,24.6 16.76,23.8 16.76,18.26 15.21,18.26 U2.42
N$119
  Top 0.051: S2.42 15.96,24.2 16.66,23.5 16.66,18.36 15.11,18.36 U2.41
N$120
  Top 0.051: S2.41 15.95,23.8 16.56,23.19 16.56,18.47 15.01,18.47 U2.40
N$121
  Top 0.051: S2.40 16,23.4 16.46,22.94 16.46,18.57 14.91,18.57 U2.39
N$122  (via drill 0.15)
  Top 0.051: U2.31 14.1,17.68 13.92,17.86 v13.92,18.52 | v14.68,20.6 S2.32
  Bottom 0.051: v13.92,18.52 13.92,19.18 14.68,19.94 v14.68,20.6
N$123  (via drill 0.15)
  Top 0.051: U2.30 13.99,17.63 13.61,18.01 v13.61,18.97 | v14.33,21.01 S2.31
  Bottom 0.051: v13.61,18.97 13.61,19.07 14.33,19.79 v14.33,21.01
N$124  (via drill 0.15)
  Top 0.051: U2.29 13.89,17.58 13.26,18.21 v13.26,18.52 | v13.92,21.36 12.97,21.36 S2.30
  Bottom 0.051: v13.26,18.52 13.26,19.07 13.92,19.74 v13.92,21.36
N$125  (via drill 0.15)
  Top 0.051: U2.28 13.79,17.53 12.85,18.47 v12.85,18.87 | v13.56,21.77 13.56,21.8 S2.29
  Bottom 0.051: v12.85,18.87 13.56,19.58 v13.56,21.77
N$126
  Top 0.051: U2.32 14.2,19.28 15.75,19.28 15.75,20.6 S2.33
N$127
  Top 0.051: U2.33 14.3,19.18 15.85,19.18 15.85,21 S2.34
N$128
  Top 0.051: U2.34 14.4,19.07 15.95,19.07 15.95,21.4 S2.35
N$129
  Top 0.051: U2.35 14.5,18.97 16.05,18.97 16.05,21.72 15.95,21.82 15.39,21.82 S2.36
N$130
  Top 0.051: S2.37 15.98,22.2 16.15,22.02 16.15,18.87 14.61,18.87 U2.36
N$131  (via drill 0.15)
  Top 0.051: v15.57,1.98 14.78,2.77 14.78,5.61 | 14.78,5.61 14.78,5.82 15.11,6.15 S4.T1 | v12.04,6.35 13.21,6.35 13.21,5.66 13.26,5.61 14.78,5.61
  Bottom 0.051: v15.57,1.98 R6.2 | v12.04,6.35 11.79,6.1 10.77,6.1 9.88,6.99 9.88,7.34 U3.11
N$132  (via drill 0.15)
  Top 0.051: v15.52,3.17 15.47,3.23 15.47,5.87 15.75,6.15 S4.T2 15.75,6.81 14.71,6.81 14.35,7.16 14.2,7.29 11.81,7.29 v10.85,8.26
  Bottom 0.051: v15.52,3.17 15.52,2.72 R5.2 | v10.85,8.26 9.78,8.26 9.22,7.7 9.22,7.37 U3.10
N$133  (via drill 0.15)
  Top 0.051: v16.84,5.77 16.38,5.77 S4.T3
  Bottom 0.051: v16.84,5.77 15.54,4.47 15.54,3.91 R4.2 15.52,3.89 14.3,3.89 12.8,2.39 12.8,0.99 12.68,0.86 11.61,0.86 11.51,0.96 11.51,2.36 10.64,3.23 10.64,4.22 10.87,4.45 10.87,4.95 10.72,5.11 9.65,5.11 7.85,6.91 7.85,7.16 8.03,7.34 U3.9
N$134
  Bottom 0.102: R0.2 8.26,2.41 8.36,2.52 10.08,2.52 10.52,2.08 10.52,1.73 U3.5
N$135  (via drill 0.15)
  Top 0.102: v15.06,4.37 15.06,4.95 15.11,5 S4.B1
  Bottom 0.102: v15.06,4.37 14.33,4.37 12.47,2.52 12.24,2.52 11.84,2.11 11.84,1.73 U3.3
N$136  (via drill 0.15)
  Top 0.051: S4.B2 15.75,5 15.85,4.9 v15.85,4.37 15.85,1.7 15.39,1.7 14.53,2.56 14.53,2.79 13.23,4.09 12.72,4.09 11.48,5.33 11.48,6.07 v11.18,6.38
  Bottom 0.051: v15.85,4.37 15.85,3.68 15.62,3.45 14.86,3.45 13.13,1.73 U3.1 | v11.18,6.38 U3.13
REF  (via drill 0.15)
  Top 0.102: U1.B1 1.52,10.01 v1.52,9.65 | v10.57,9.6 10.57,10.19 U2.B1
  Bottom 0.102: v1.52,9.65 1.52,11.02 1.55,11.05 | 1.55,11.05 2.08,11.58 8.59,11.58 | 8.59,11.58 v10.57,9.6 | 8.59,11.58 18.09,11.58 REF.1 18.85,7.2 18.85,0.61 11.17,0.61 U3.4 | REF..1 1.52,11.07 1.55,11.05
SCLK+  (via drill 0.15)
  Top 0.051: U1.B12 6.22,10.39 6.22,7.87 7.59,6.5 7.59,6.17 S3.T2 7.87,5.89 7.87,4.45 | U2.B12 14.99,10.44 14.99,7.92 v15.21,7.7 | 12.27,3.63 12.27,3.71 R2.2
  Top 0.102: 12.27,3.63 v11.81,3.63 8.69,3.63 7.87,4.45
  Bottom 0.051: v15.21,7.7 15.21,6.27 13.11,4.17 13.11,3.68 12.95,3.53 11.91,3.53 v11.81,3.63
SCLK-  (via drill 0.15)
  Top 0.051: U1.B11 5.97,10.39 5.97,7.98 7.34,6.6 7.34,5.28 S3.B2 | U2.B11 14.83,10.39 v14.83,7.32 | v12.83,3.81 12.57,3.56 12.57,3.23 R2.1 12.27,2.95
  Top 0.102: 12.27,2.95 9.47,2.95 8.38,2.95 7.61,3.72 S3.B2
  Bottom 0.051: v14.83,7.32 14.83,6.04 12.83,4.04 v12.83,3.81
VCC  (via drill 0.15)
  Top 0.102: S3.T6 10.16,6.17 10.16,6.68 13.08,6.68 13.34,6.43 13.34,6.38 C1.1 13.72,6.04 v14.33,6.04 | U1.B7 U1.B6 U1.B5 U1.B4 2.59,10.72 2.29,10.72 2.23,10.62 2.23,10.52 U1.B2 2.18,9.63 v2.79,9.63 | U2.B2 11.1,10.41 11.1,10.31 11.15,10.26 | 11.15,10.26 11.46,10.26 U2.B4 U2.B5 U2.B6 U2.B7 | U2.B21 16.94,10.52 16.94,10.62 16.89,10.72 16.38,10.72 U2.B18 U2.B17 v16.18,9.63 | U1.B18 7.42,10.46 | 7.42,10.46 U1.B17 | U1.B21 8.08,10.41 v8.08,9.63 | v7.42,9.63 7.42,10.46 | v11.15,9.63 11.15,10.26
  Bottom 0.102: 13.13,7.34 U3.16 13.18,7.34 v13.56,7.72 | C3.1 3.96,9.14 v2.79,9.63
  pour Route2: 0.25,0.41 0.25,10.26 19.05,10.26 19.05,0.41

### Text on the board
tPlace: 127 | 0 | 63 | 64 | REF | GND | Intan Technologies | www.intantech.com | 31 | 32 | 95 | 96 | 0-63 | 64-127 | 6mm | MOUNT
bPlace: REF | GND | www.intantech.com | Intan Technologies | 128-channel amplifier board | REF | GND | VDD